# EAGLE design scHnRk_2 (EAGLE 7.5.0)
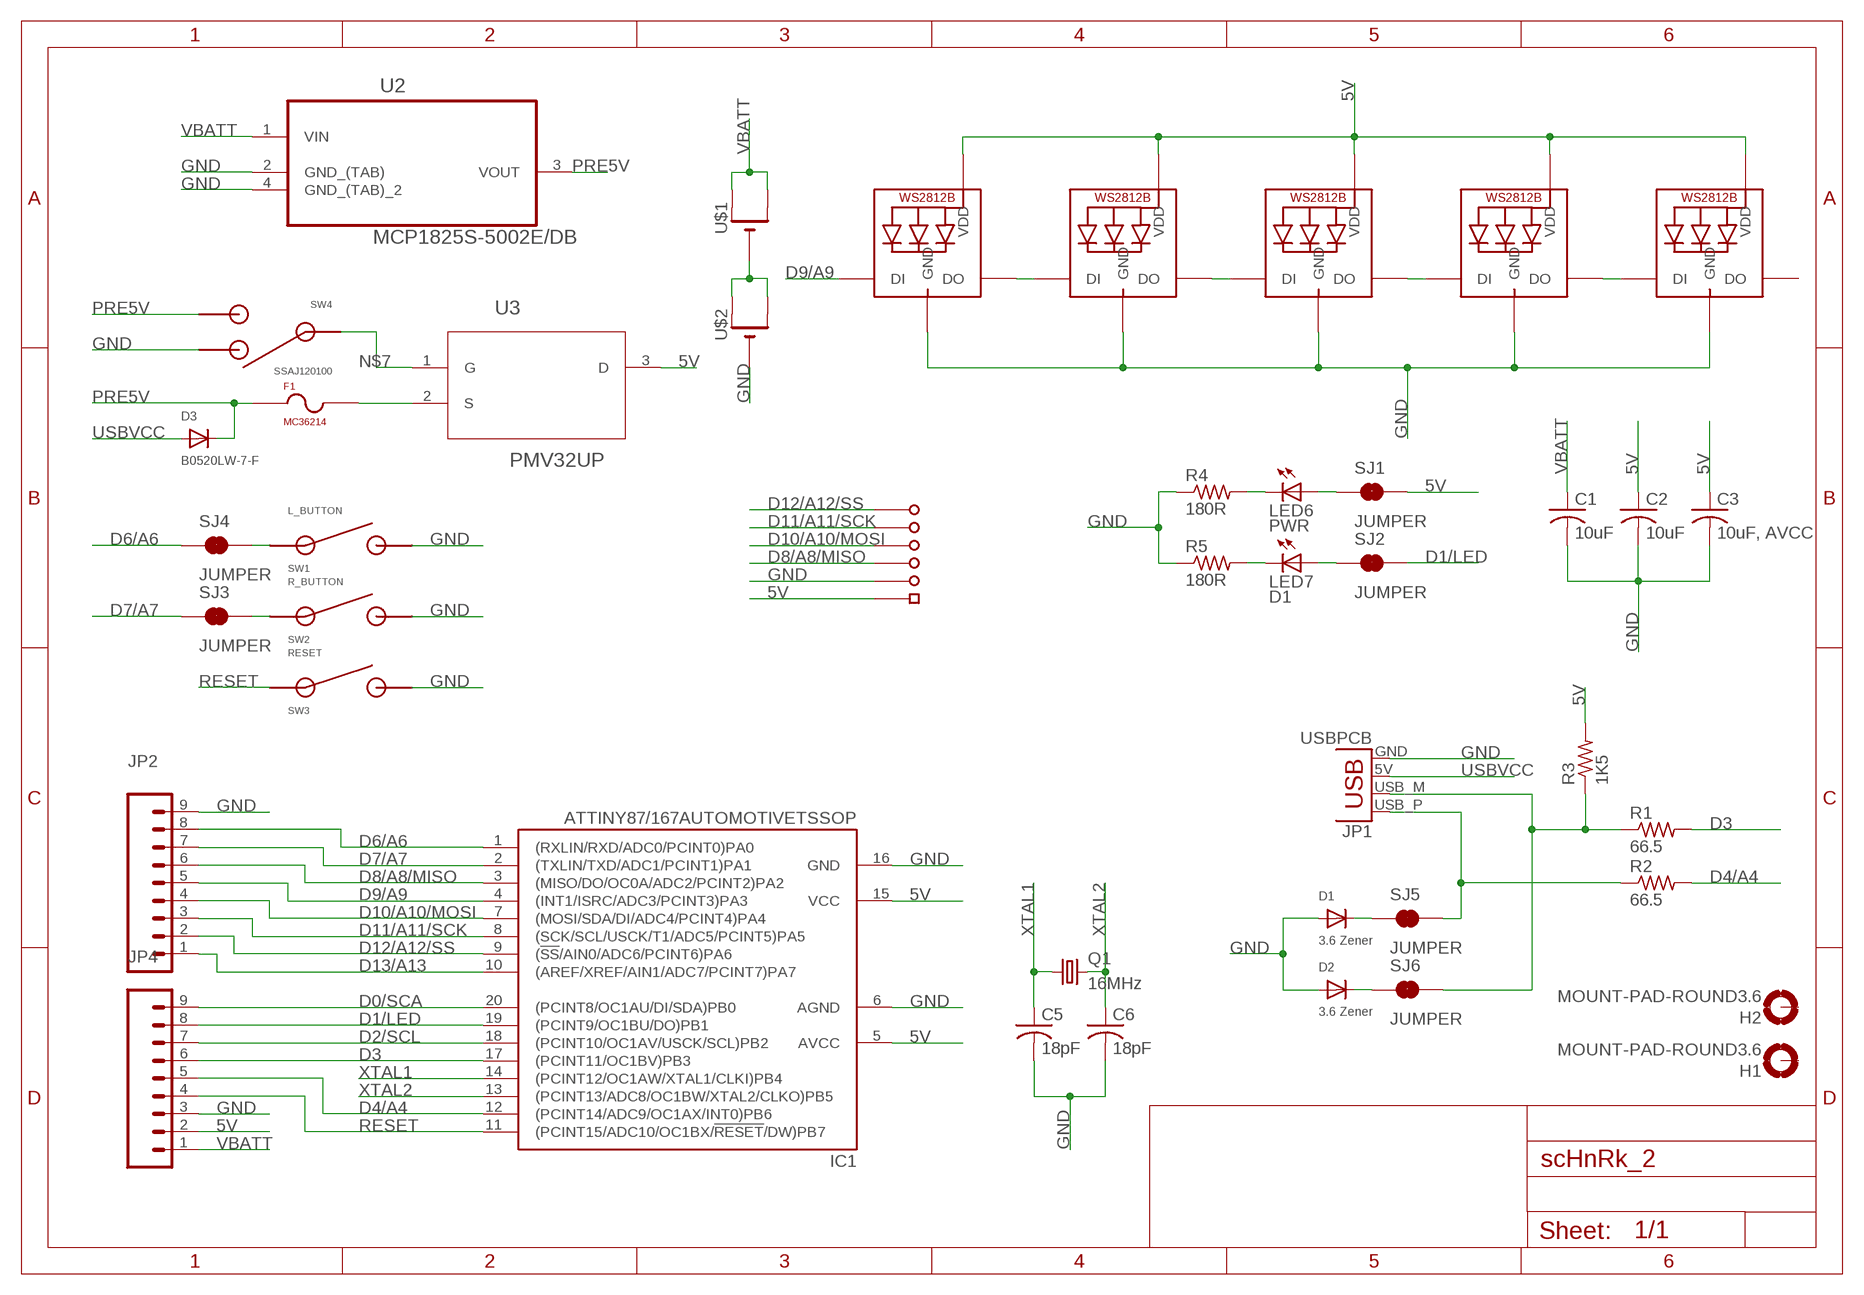
[diagram p0: schematic, sheet 1]

## Parts
C1  10uF  C-USC1206K  [C1206K]
C2  10uF  C-USC1206K  [C1206K]
C3  10uF, AVCC  C-USC1206K  [C1206K]
C5  18pF  C-USC0603K  [C0603K]
C6  18pF  C-USC0603K  [C0603K]
D1  3.6 Zener  DIODESOD-523  [SOD-523]
D2  3.6 Zener  DIODESOD-523  [SOD-523]
D3  B0520LW-7-F  DIODESOD-123  [SOD-123]
F1  MC36214  [MC36214]
H1  MOUNT-PAD-ROUND3.6  [3,6-PAD]
H2  MOUNT-PAD-ROUND3.6  [3,6-PAD]
IC1  ATTINY87/167AUTOMOTIVETSSOP  [TSSOP20]
JP1  USBPCB  [USB-A-PCB]
JP2  M09  [1X09]
JP4  M09  [1X09]
LED1  WS2812B5050  [WS2812B]
LED2  WS2812B5050  [WS2812B]
LED3  WS2812B5050  [WS2812B]
LED4  WS2812B5050  [WS2812B]
LED5  WS2812B5050  [WS2812B]
LED6  PWR  LEDCHIPLED_0603  [CHIPLED_0603]
LED7  D1  LEDCHIPLED_0603  [CHIPLED_0603]
Q1  16MHz  CRYSTALHC49UP  [HC49UP]
R1  66.5  R-US_R0603  [R0603]
R2  66.5  R-US_R0603  [R0603]
R3  1K5  R-US_R0603  [R0603]
R4  180R  R-US_R0603  [R0603]
R5  180R  R-US_R0603  [R0603]
SJ1  JUMPER  JUMPER-PAD-2-NC_BY_TRACE  [PAD-JUMPER-2-NC_BY_TRACE_YES_SILK]
SJ2  JUMPER  JUMPER-PAD-2-NC_BY_TRACE  [PAD-JUMPER-2-NC_BY_TRACE_YES_SILK]
SJ3  JUMPER  JUMPER-PAD-2-NC_BY_TRACE  [PAD-JUMPER-2-NC_BY_TRACE_YES_SILK]
SJ4  JUMPER  JUMPER-PAD-2-NC_BY_TRACE  [PAD-JUMPER-2-NC_BY_TRACE_YES_SILK]
SJ5  JUMPER  JUMPER-PAD-2-NC_BY_TRACE  [PAD-JUMPER-2-NC_BY_TRACE_YES_SILK]
SJ6  JUMPER  JUMPER-PAD-2-NC_BY_TRACE  [PAD-JUMPER-2-NC_BY_TRACE_YES_SILK]
SW1  L_BUTTON  SKRBAGE010  [SKRBAGE010]
SW2  R_BUTTON  SKRBAGE010  [SKRBAGE010]
SW3  RESET  SKRBAGE010  [SKRBAGE010]
SW4  SSAJ120100  [SSAJ120100]
TP1  TP-R  [TP-R]
TP2  TP-S  [TP_S]
TP3  TP-R  [TP-R]
TP4  TP-R  [TP-R]
TP5  TP-R  [TP-R]
TP6  TP-R  [TP-R]
U2  MCP1825S-5002E/DB  [SOT230P700X180-4N]
U3  PMV32UP  [SOT95P230X110-3N]
U$1  CR2032SMT  [CR2032-SMD]
U$2  CR2032SMT  [CR2032-SMD]

## Nets
5V: C2.1 C3.1 IC1.5(AVCC) IC1.15(VCC) JP4.2 LED1.1-VDD(VDD) LED2.1-VDD(VDD) LED3.1-VDD(VDD) LED4.1-VDD(VDD) LED5.1-VDD(VDD) R3.2 SJ1.2 TP2.P$1 U3.3(D)
D0/SCA: IC1.20((PCINT8/OC1AU/DI/SDA)PB0) JP4.9
D1/LED: IC1.19((PCINT9/OC1BU/DO)PB1) JP4.8 SJ2.2
D2/SCL: IC1.18((PCINT10/OC1AV/USCK/SCL)PB2) JP4.7
D3: IC1.17((PCINT11/OC1BV)PB3) JP4.6 R1.2
D4/A4: IC1.12((PCINT14/ADC9/OC1AX/INT0)PB6) JP4.5 R2.2
D6/A6: IC1.1((RXLIN/RXD/ADC0/PCINT0)PA0) JP2.8 SJ4.1
D7/A7: IC1.2((TXLIN/TXD/ADC1/PCINT1)PA1) JP2.7 SJ3.1
D8/A8/MISO: IC1.3((MISO/DO/OC0A/ADC2/PCINT2)PA2) JP2.6 TP3.P$1
D9/A9: IC1.4((INT1/ISRC/ADC3/PCINT3)PA3) JP2.5 LED1.4-DIN(DI)
D10/A10/MOSI: IC1.7((MOSI/SDA/DI/ADC4/PCINT4)PA4) JP2.4 TP4.P$1
D11/A11/SCK: IC1.8((SCK/SCL/USCK/T1/ADC5/PCINT5)PA5) JP2.3 TP5.P$1
D12/A12/SS: IC1.9((!SS!/AIN0/ADC6/PCINT6)PA6) JP2.2 TP6.P$1
D13/A13: IC1.10((AREF/XREF/AIN1/ADC7/PCINT7)PA7) JP2.1
GND: C1.2 C2.2 C3.2 C5.2 C6.2 D1.A D2.A IC1.6(AGND) IC1.16(GND) JP1.GND JP2.9 JP4.3 LED1.3-GND(GND) LED2.3-GND(GND) LED3.3-GND(GND) LED4.3-GND(GND) LED5.3-GND(GND) R4.1 R5.1 SW1.P$2 SW1.P$4 SW2.P$2 SW2.P$4 SW3.P$2 SW3.P$4 SW4.P$1 TP1.P$1 U2.2(GND_(TAB)) U2.4(GND_(TAB)_2) U$2.-
N$1: U$1.- U$2.+$1(+) U$2.+$2(+1)
N$2: SJ4.2 SW1.P$1 SW1.P$3
N$3: LED1.2-DOUT(DO) LED2.4-DIN(DI)
N$4: LED2.2-DOUT(DO) LED3.4-DIN(DI)
N$5: LED3.2-DOUT(DO) LED4.4-DIN(DI)
N$6: LED4.2-DOUT(DO) LED5.4-DIN(DI)
N$7: SW4.P$C U3.1(G)
N$8: SJ3.2 SW2.P$1 SW2.P$3
N$9: D1.K(C) SJ5.1
N$10: D2.K(C) SJ6.1
N$15: JP1.USB_M(D-) R1.1 R3.1 SJ6.2
N$16: JP1.USB_P(D+) R2.1 SJ5.2
N$22: F1.P$2 U3.2(S)
N$28: LED6.C R4.2
N$29: LED7.C R5.2
N$31: LED6.A SJ1.1
N$34: LED7.A SJ2.1
PRE5V: D3.C F1.P$1 SW4.P$2 U2.3(VOUT)
RESET: IC1.11((PCINT15/ADC10/OC1BX/!RESET!/DW)PB7) JP4.4 SW3.P$1 SW3.P$3
USBVCC: D3.A JP1.5V(VBUS)
VBATT: C1.1 JP4.1 U2.1(VIN) U$1.+$1(+) U$1.+$2(+1)
XTAL1: C5.1 IC1.14((PCINT12/OC1AW/XTAL1/CLKI)PB4) Q1.1
XTAL2: C6.1 IC1.13((PCINT13/ADC8/OC1BW/XTAL2/CLKO)PB5) Q1.2
Unconnected: H1.B3,6(MOUNT) H2.B3,6(MOUNT) LED5.2-DOUT(DO)

## Library data of the parts
C1-C3 C5 C6 = adafruit:C-US: CAPACITOR, American symbol
D1-D3 = adafruit:DIODE: Diode SMADIODE - SMA Surface Mount Package 20V 1A Schottky Diode Digikey: 641-1014-6-ND DO-1N4148 - Through Hole Small Current Diode SOD-123 20V 1 A (.5mV Vf) Schottky Diode - Digikey: MBRX120TPMSCT-ND SOD-323 10V 570mA (.38mV Vf, 3ns) Schottky Diode - Digikey: ZLLS410CT-ND SOD-523 30V 30mA Schottky Diode (RB751S-40TE61) - Digikey: RB751S-40TE61CT-ND SOT23-R/W - SOT23 Package (R = Solder Paste/Reflow Ovens, W = Hand-Soldering) BAT54Film 40V 300mA - Digikey: 497-7162-1-ND
F1 = scHnRk:MC36214
H1 H2 = holes:MOUNT-PAD-ROUND: MOUNTING PAD, round
IC1 = attiny87_167_automotive:ATTINY87/167AUTOMOTIVE
JP1 = SparkFun-Connectors:USB: USB Connectors USB-B-PTH is fully proven SKU : PRT-00139/CONN-08278 USB-miniB is fully proven SKU : PRT-00587 USB-A-PCB is untested. USB-A-H is throughly reviewed, but untested. Spark Fun Electronics SKU : PRT-00437 USB-B-SMT is throughly reviewed, but untested. Needs silkscreen touching up. USB-A-S has not been used/tested USB-MB-H has not been used/tested USB-MICROB has been used. CONN-09505
JP2 JP4 = SparkFun-Connectors:M09: Header 9 Standard 9-pin 0.1" header. Use with straight break away headers (SKU : PRT-00116), right angle break away headers (PRT-00553), swiss pins (PRT-00743), machine pins (PRT-00117), and female headers (PRT-00115).
LED1-LED5 = adafruit:WS2812B
LED6 LED7 = adafruit:LED: LED OSRAM: - CHIPLED LG R971, LG N971, LY N971, LG Q971, LY Q971, LO R971, LY R971 LH N974, LH R974 LS Q976, LO Q976, LY Q976 LO Q996 - Hyper CHIPLED LW Q18S LB Q993, LB Q99A, LB R99A - SideLED LS A670, LO A670, LY A670, LG A670, LP A670 LB A673, LV A673, LT A673, LW A673 LH A674 LY A675 LS A676, LA A676, LO A676, LY A676, LW A676 LS A679, LY A679, LG A679 - Hyper Micro SIDELED® LS Y876, LA Y876, LO Y876, LY Y876 LT Y87S - SmartLED LW L88C, LW L88S LB L89C, LB L89S, LG L890 LS L89K, LO L89K, LY L89K LS L896, LA L896, LO L896, LY L896 - TOPLED LS T670, LO T670, LY T670, LG T670, LP T670 LSG T670, LSP T670, LSY T670, LOP T670, LYG T670 LG T671, LOG T671, LSG T671 LB T673, LV T673, LT T673, LW T673 LH T674 LS T676, LA T676, LO T676, LY T676, LB T676, LH T676, LSB T676, LW T676 LB T67C, LV T67C, LT T67C, LS T67K, LO T67K, LY T67K, LW E67C LS E67B, LA E67B, LO E67B, LY E67B, LB E67C, LV E67C, LT E67C LW T67C LS T679, LY T679, LG T679 LS T770, LO T770, LY T770, LG T770, LP T770 LB T773, LV T773, LT T773, LW T773 LH T774 LS E675, LA E675, LY E675, LS T675 LS T776, LA T776, LO T776, LY T776, LB T776 LHGB T686 LT T68C, LB T68C - Hyper Mini TOPLED® LB M676 - Mini TOPLED Santana® LG M470 LS M47K, LO M47K, LY M47K Source: http://www.osram.convergy.de/
Q1 = adafruit:CRYSTAL: CRYSTAL; OC_FARNELL: unknown; OC_NEWARK: unknown
R1-R5 = adafruit:R-US_: RESISTOR, American symbol
SJ1-SJ6 = SparkFun-Passives:JUMPER-PAD-2-NC_BY_TRACE
SW1-SW3 = scHnRk:SKRBAGE010
SW4 = scHnRk:SSAJ120100
TP1 TP3-TP6 = scHnRk:TP-R
TP2 = scHnRk:TP-S
U2 = Microchip_By_element14_Batch_1:MCP1825S-5002E/DB: IC, LDO, 5.0V, 500MA; MPN: MCP1825S-5002E/DB; OC_FARNELL: 1578407; OC_NEWARK: 26M9964; PACKAGE: SOT-223-3; SUPPLIER: Microchip
U3 = NXP_By_element14_Batch_1:PMV32UP: P-channel Trench MOSFET; MPN: PMV32UP; OC_FARNELL: 1894624; OC_NEWARK: 47T2356; PACKAGE: SOT-3; SUPPLIER: NXP Semiconductors
U$1 U$2 = adafruit:CR2032

## Board
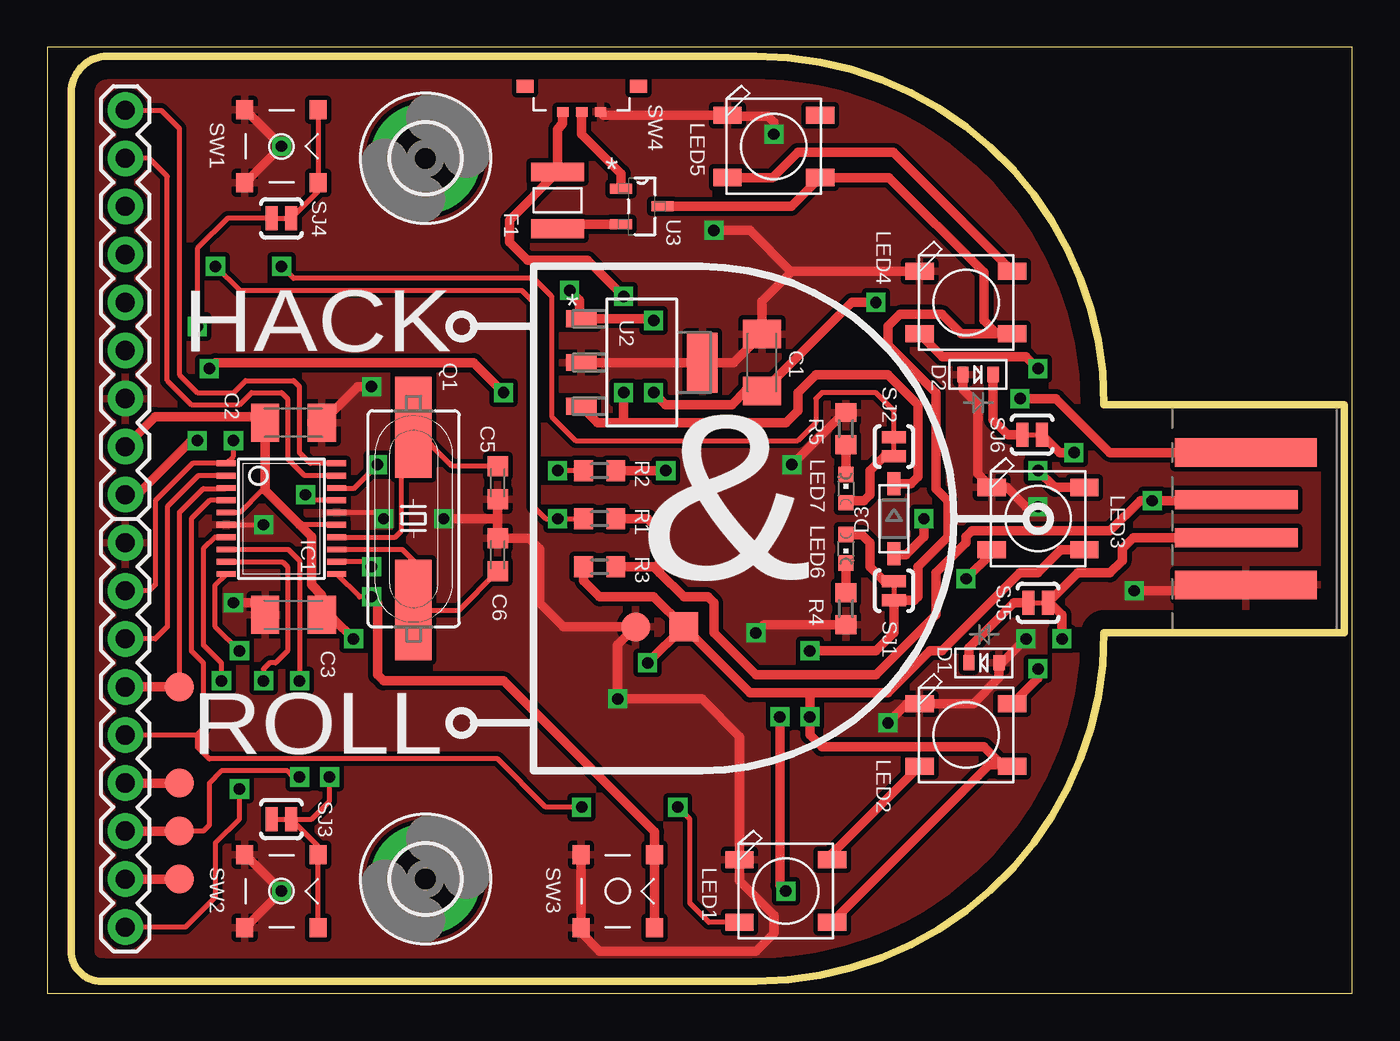
[diagram p1: board, top side]
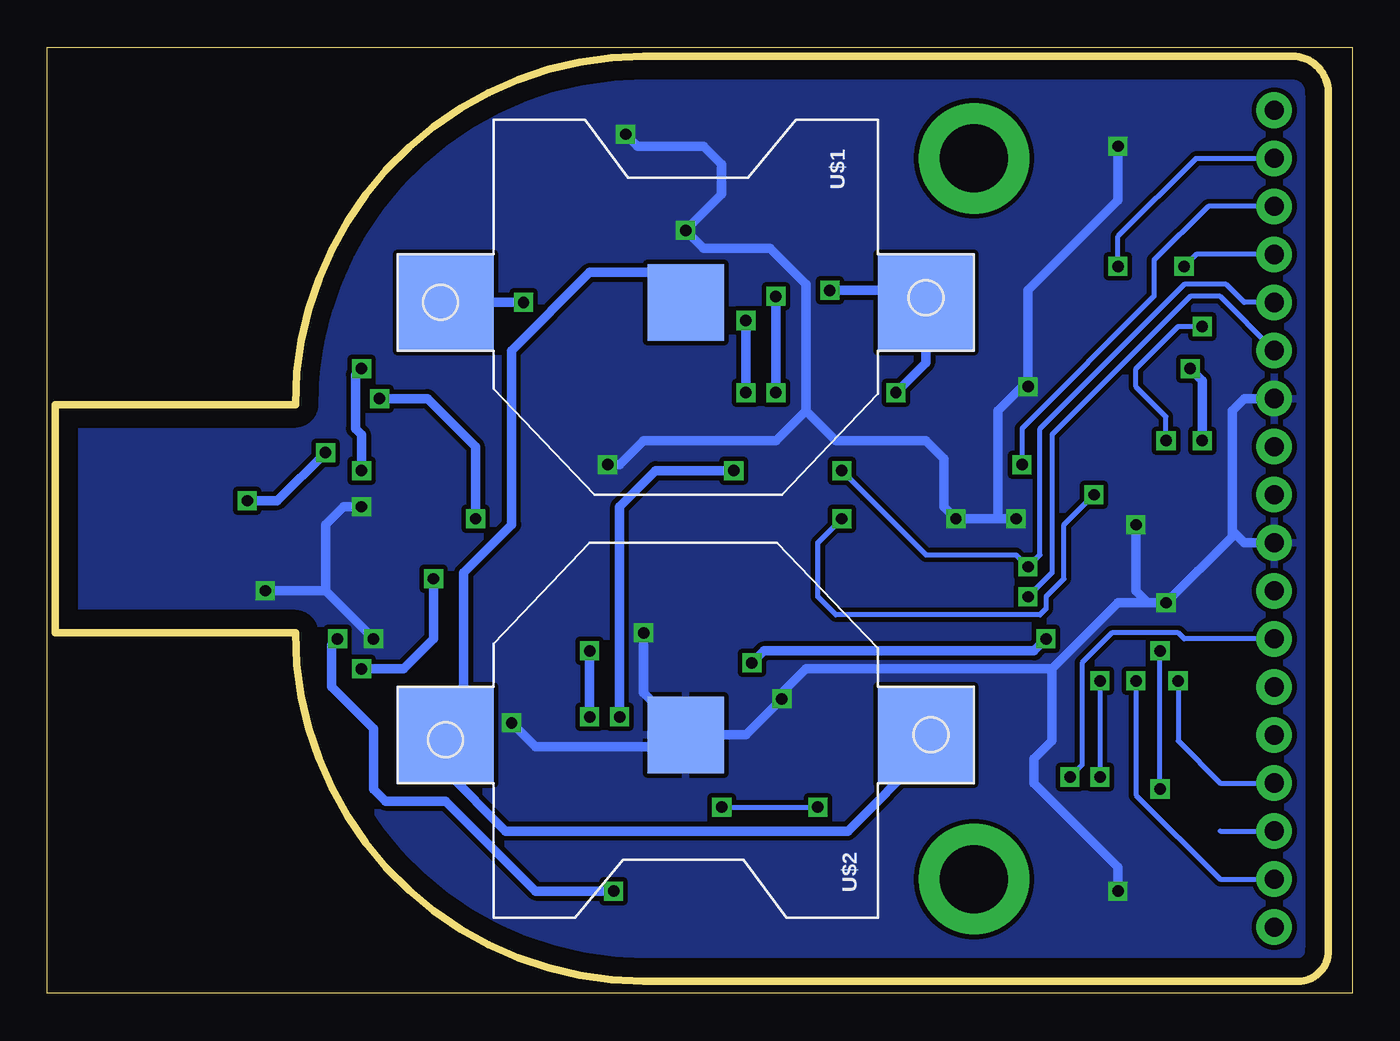
[diagram p2: board, bottom side, seen from below]

Size 69 x 50 mm. Coordinates in mm from the lower left corner, seen from the top.
Outline: 0,0 69,0 69,50 0,50 0,0
Outline: 3.17,49.53 arc90 1.27,47.62 1.27,2.22 arc90 2.86,0.64 37.47,0.64 arc90 55.88,19.05 68.58,19.05 68.58,31.11 55.88,31.11 arc90 37.47,49.53 3.17,49.53
Copper layers (1*16): Top 0.035mm / dielectric 1.5mm / Bottom 0.035mm
Design rules "default *": minimum track width 10mil, minimum drill 20mil, track to track 10mil, track to pad 10mil, pad to pad 10mil, via to via 12mil, smd to smd 10mil, copper to edge 40mil, drill to drill 20mil, minimum pad ring 10mil, minimum via ring 8mil, stop-mask expansion 4mil, vias tented up to drill 0mil, thermal gap 10mil

### Footprints (pad centres in the part's own frame; a part is rotated, then mirrored left to right if it is on the bottom)
C1206K = smd 1.5 x 2: 1 -1.5,0; 2 1.5,0
C0603K = smd 1.05 x 1.08: 1 -0.875,0; 2 0.875,0
SOD-523 = smd 0.8 x 0.6: A 0,-0.8; K 0,0.8
SOD-123 = smd 1.2 x 0.7: A 1.85,0; C -1.85,0
MC36214 = smd 1 x 2.8: P$1 -1.5,0; P$2 1.5,0
3,6-PAD = drill 3.6 pad 5.842: B3,6 0,0
TSSOP20 = smd 0.305 x 0.991: 1 -2.925,-2.918; 2 -2.275,-2.918; 3 -1.625,-2.918; 4 -0.975,-2.918; 5 -0.325,-2.918; 6 0.325,-2.918; 7 0.975,-2.918; 8 1.625,-2.918; 9 2.275,-2.918; 10 2.925,-2.918; 11 2.925,2.918; 12 2.275,2.918; 13 1.625,2.918; 14 0.975,2.918; 15 0.325,2.918; 16 -0.325,2.918; 17 -0.975,2.918; 18 -1.625,2.918; 19 -2.275,2.918; 20 -2.925,2.918
USB-A-PCB = smd 7.5 x 1.5: 5V -0.2,-3.5; GND -0.2,3.5 | smd 6.5 x 1: USB_M 0.3,-1; USB_P 0.3,1
1X09 = drill 1.016 pad 1.88: 1 0,0; 2 2.54,0; 3 5.08,0; 4 7.62,0; 5 10.16,0; 6 12.7,0; 7 15.24,0; 8 17.78,0; 9 20.32,0
WS2812B = smd 1.5 x 0.9: 1-VDD 2.45,-1.65; 2-DOUT 2.45,1.65; 3-GND -2.45,1.65; 4-DIN -2.45,-1.65
CHIPLED_0603 = smd 0.8 x 0.8: A 0,-0.75; C 0,0.75
HC49UP = smd 5.334 x 1.93: 1 -4.826,0; 2 4.826,0
R0603 = smd 1 x 1.1: 1 -0.85,0; 2 0.85,0
PAD-JUMPER-2-NC_BY_TRACE_YES_SILK = smd 0.635 x 1.27: 1 -0.508,0; 2 0.508,0
SKRBAGE010 = smd 1 x 0.9: P$1 -1.925,1.95; P$2 -1.925,-1.95; P$3 1.925,1.95; P$4 1.925,-1.95
SSAJ120100 = smd 0.6 x 0.51: P$1 -1,1.36; P$2 1,1.36; P$C 0,1.36 | smd 0.9 x 0.7: P$3 -3,0; P$4 3,0
TP-R = smd 1.524 x 1.524: P$1 0,0
TP_S = smd 1.524 x 1.524: P$1 0,0
SOT230P700X180-4N = smd 1.626 x 0.889: 1 -3.2,2.311; 2 -3.2,0; 3 -3.2,-2.311 | smd 1.626 x 3.175: 4 3.2,0
SOT95P230X110-3N = smd 1.168 x 0.533: 1 -1.092,0.94; 2 -1.092,-0.94; 3 1.092,0
CR2032-SMD = smd 5.08 x 5.08: +$1 -12.7,0; +$2 12.7,0 | smd 4.064 x 4.064: - 0,0

### Placement (x,y rotation side)
C1  37.78,33.34 90 top
C2  13.02,30.16 0 top
C3  13.02,20 180 top
C5  23.81,26.99 270 top
C6  23.81,23.18 90 top
D1  49.53,17.46 90 top
D2  49.21,32.7 270 top
D3  44.77,25.08 270 top
F1  26.99,41.91 270 top
H1  20,44.13 0 top
H2  20,6.03 0 top
IC1  12.38,25.08 270 top
JP1  63.18,25.08 180 top
JP2  4.13,3.49 90 top
JP4  4.13,26.35 90 top
LED1  39.05,5.4 0 top
LED2  48.58,13.65 0 top
LED3  52.39,25.08 0 top
LED4  48.58,36.51 0 top
LED5  38.42,44.77 0 top
LED6  42.23,23.5 180 top
LED7  42.23,26.67 0 top
Q1  19.37,25.08 270 top
R1  29.21,25.08 180 top
R2  29.21,27.62 180 top
R3  29.21,22.54 180 top
R4  42.23,20.32 90 top
R5  42.23,29.84 270 top
SJ1  44.77,21.27 270 top
SJ2  44.77,28.89 90 top
SJ3  12.38,9.21 0 top
SJ4  12.38,40.96 0 top
SJ5  52.39,20.64 0 top
SJ6  52.07,29.53 0 top
SW1  12.38,44.77 270 top
SW2  12.38,5.4 270 top
SW3  30.16,5.4 270 top
SW4  28.26,47.94 180 top
TP1  31.11,19.37 90 top
TP2  33.66,19.37 90 top
TP3  6.99,16.19 90 top
TP4  6.99,11.11 180 top
TP5  6.99,8.57 180 top
TP6  6.99,6.03 180 top
U2  31.43,33.34 0 top
U3  31.43,41.59 0 top
U$1  35.24,36.51 0 bottom
U$2  35.24,13.65 180 bottom

### Tracks (layer width: path | path; a pad name or v marks a point on that pad's centre or on a via)
5V  (via drill 0.6)
  Top 0.254: 33.02,20 TP2.P$1 | 11.52,26.58 11.34,26.58 10.16,25.4 9.47,25.4 IC1.5 | IC1.15 13.34,24.76 13.34,24.77
  Top 0.508: U3.3 39.34,41.59 LED5.1-VDD 44.51,43.12 49.53,38.1 49.53,35.56 50.16,34.92 50.97,34.92 LED4.1-VDD 48.32,34.86 47.31,35.88 45.09,35.88 44.45,35.24 44.45,34.29 46.99,31.75 46.99,26.67 47.62,26.04 47.62,24.13 46.04,22.54 46.04,20.95 45.85,20.77 SJ1.2 44.77,19.05 43.81,18.1 v40.32,18.1 | LED3.1-VDD 53.59,23.43 52.39,22.23 51.44,22.23 47.31,18.1 46.67,18.1 44.45,15.88 40.32,15.88 | 50.48,12.06 49.53,13.02 40.96,13.02 40.32,13.65 v40.32,14.61 40.32,15.88 | 50.48,12.06 50.97,12.06 LED2.1-VDD | 50.48,12.06 49.82,12.06 LED1.1-VDD | 11.11,30.48 5.71,30.48 JP4.2 | 11.11,30.48 11.2,30.48 C2.1 | C2.1 11.43,30.16 11.11,30.48 | TP2.P$1 32.07,20.95 29.21,20.95 28.36,21.8 R3.2 | v31.75,17.46 TP2.P$1 | v16.19,18.73 15.15,19.77 14.52,19.77 C3.1 14.52,21.04 13.97,21.59 13.97,24.13 13.34,24.77 11.52,26.58 C2.1 | 40.32,15.88 37.15,15.88 TP2.P$1
  Bottom 0.508: v40.32,18.1 v40.32,14.61 | v16.19,18.73 16.83,18.1 31.11,18.1 v31.75,17.46
D0/SCA
  Top 0.254: IC1.20 13.9,28.01 13.34,28.57 13.34,32.07 13.02,32.38 10.48,32.38 9.84,31.75 7.94,31.75 6.99,32.7 6.99,45.72 6.03,46.67 JP4.9
D1/LED  (via drill 0.6)
  Top 0.254: IC1.19 13.6,27.36 12.7,28.26 12.7,31.43 12.38,31.75 10.79,31.75 10.16,31.11 7.62,31.11 6.35,32.38 6.35,43.18 5.4,44.13 JP4.8 | SJ2.2 44.77,30.8 43.81,31.75 40.96,31.75 40.64,31.43 40.64,30.16 39.69,29.21 27.94,29.21 26.67,30.48 26.67,36.83 25.72,37.78 13.02,37.78 v12.38,38.42
  Bottom 0.254: JP4.8 8.26,44.13 12.38,40.01 v12.38,38.42
D2/SCL  (via drill 0.6)
  Top 0.254: IC1.18 15.34,26.67 16.19,26.67 v17.46,27.94
  Bottom 0.254: JP4.7 7.62,41.59 10.48,38.73 10.48,36.83 17.46,29.84 v17.46,27.94
D3  (via drill 0.6)
  Top 0.254: IC1.17 13.95,26.06 v13.65,26.35 | v8.89,38.42 10.16,37.15 25.08,37.15 25.72,36.51 25.72,25.72 26.35,25.08 v26.99,25.08 R1.2
  Bottom 0.254: JP4.6 8.26,39.05 v8.89,38.42 | v13.65,26.35 15.24,24.77 15.24,21.91 16.19,20.95 16.19,20.32 16.51,20 27.3,20 28.26,20.95 28.26,23.81 v26.99,25.08
D4/A4  (via drill 0.6)
  Top 0.254: v17.14,22.54 16.88,22.81 IC1.12 | R2.2 v26.99,27.62
  Bottom 0.254: JP4.5 5.71,36.51 6.67,37.47 8.89,37.47 16.51,29.84 16.51,23.18 v17.14,22.54 17.78,23.18 22.54,23.18 v26.99,27.62
D6/A6  (via drill 0.6)
  Top 0.254: JP2.8 5.4,21.27 5.71,21.59 5.71,26.04 7.69,28.01 IC1.1 9.84,28.39 v9.84,29.21 | SJ4.1 9.53,40.96 7.94,39.37 v7.94,35.24
  Bottom 0.254: v9.84,29.21 9.84,30.48 11.43,32.07 11.43,33.02 9.21,35.24 v7.94,35.24
D7/A7  (via drill 0.6)
  Top 0.254: JP2.7 5.71,18.73 6.35,19.37 6.35,25.72 7.99,27.36 IC1.2 | SJ3.1 13.97,9.21 14.92,10.16 v14.92,11.43
  Bottom 0.254: JP2.7 8.89,18.73 9.21,19.05 12.7,19.05 14.29,17.46 14.29,12.06 v14.92,11.43
D8/A8/MISO
  Top 0.254: IC1.3 9.43,26.67 8.26,26.67 6.99,25.4 TP3.P$1
  Top 0.508: JP2.6 TP3.P$1
D9/A9  (via drill 0.6)
  Top 0.254: 7.94,13.65 7.94,13.02 8.57,12.38 23.81,12.38 26.35,9.84 v28.26,9.84 | JP2.5 7.94,13.65 | LED1.4-DIN 34.99,3.75 33.97,4.76 33.97,9.21 v33.34,9.84 | IC1.4 8.6,26.06 7.62,25.08 7.62,18.1 8.26,17.46 8.26,13.97 7.94,13.65
  Bottom 0.254: v33.34,9.84 v28.26,9.84
D10/A10/MOSI  (via drill 0.6)
  Top 0.254: IC1.7 8.87,24.11 8.26,23.5 8.26,18.41 9.21,17.46 v9.21,16.51
  Top 0.508: JP2.4 TP4.P$1
  Bottom 0.254: v9.21,16.51 9.21,13.34 TP4.P$1 JP2.4
D11/A11/SCK  (via drill 0.6)
  Top 0.254: IC1.8 12.74,23.46 13.34,22.86 v13.34,16.51 | v13.34,11.43 13.02,11.43 12.7,11.75 9.21,11.75 8.57,11.11 8.57,8.89 8.26,8.57 TP5.P$1
  Top 0.508: JP2.3 TP5.P$1
  Bottom 0.254: TP5.P$1 JP2.3 | v13.34,16.51 v13.34,11.43
D12/A12/SS  (via drill 0.6)
  Top 0.254: IC1.9 12.44,22.81 12.7,22.54 12.7,18.1 12.06,17.46 11.75,17.46 11.43,17.14 v11.43,16.51
  Top 0.508: JP2.2 TP6.P$1
  Bottom 0.254: v11.43,16.51 11.43,10.48 TP6.P$1 JP2.2
D13/A13  (via drill 0.6)
  Top 0.254: v10.16,18.1 8.89,19.37 8.89,21.58 IC1.10 | JP2.1 7.3,3.49 8.89,5.08 8.89,7.94 10.16,9.21 v10.16,10.79
  Bottom 0.254: v10.16,10.79 v10.16,18.1
GND  (via drill 0.6)
  Top 0.254: 14.61,30.25 C2.2 14.61,30.16 | SW1.P$2 10.46,46.69 | SW1.P$4 10.46,42.84 | IC1.16 17.45,25.41 v17.78,25.08 | IC1.6 9.47,24.77 v11.43,24.77 | SW2.P$2 10.46,7.32 | C3.2 11.52,20.64
  Top 0.508: v35.24,40.32 37.15,40.32 39.31,38.16 39.37,38.16 | v38.42,45.4 38.42,46.04 38.1,46.35 36.03,46.35 LED5.3-GND 29.42,46.42 SW4.P$1 | U2.2 U2.4 36.28,33.34 C1.2 37.78,36.58 39.37,38.16 | v51.75,18.73 50.48,17.46 D1.A 50.33,16.68 48.96,15.3 LED2.3-GND 45.47,15.3 v44.45,14.29 | v57.47,21.27 63.07,21.27 JP1.GND | 42.12,30.7 R5.1 42.23,30.8 v39.37,27.94 | C5.2 23.81,25.08 | 23.81,25.08 C6.2 25.48,24.05 26.04,23.5 26.04,20.64 27.3,19.37 TP1.P$1 30.16,18.41 v30.16,15.56 34.61,15.56 36.6,13.56 LED1.3-GND | 36.51,6.96 LED1.3-GND | LED1.3-GND 36.6,5.94 38.42,4.13 38.42,3.17 37.47,2.22 29.21,2.22 28.21,3.22 SW3.P$4 SW3.P$2 | R4.1 37.88,19.47 v37.47,19.05 | v20.95,25.08 23.81,25.08 | v17.14,32.07 16.42,32.07 C2.2 | 10.46,46.69 v12.38,44.77 10.46,42.84 | LED4.3-GND 39.37,38.16 | D2.A 48.41,31.91 49.21,31.11 49.21,27.46 LED3.3-GND 50.74,26.73 51.75,25.72 v52.39,25.72 | v9.84,20.64 11.52,20.64 | 10.46,7.32 v12.38,5.4 10.46,3.47 SW2.P$4
  Bottom 0.508: v38.42,45.4 37.78,44.77 34.29,44.77 33.34,43.81 33.34,42.23 v35.24,40.32 34.29,39.37 30.8,39.37 28.89,37.47 28.89,30.8 | v51.75,18.73 54.29,21.27 | 54.29,21.27 v57.47,21.27 | v39.37,27.94 38.73,27.94 37.47,29.21 30.48,29.21 28.89,30.8 | U$2.- 32.07,13.65 v30.16,15.56 30.16,15.88 28.89,17.14 15.88,17.14 | JP4.3 5.71,31.43 6.35,30.8 6.35,24.45 | 6.35,24.45 5.71,23.81 JP2.9 | v37.47,19.05 37.47,15.88 U$2.- | U$2.- 35.88,13.02 43.18,13.02 v44.45,14.29 | 28.89,30.8 27.3,29.21 22.54,29.21 21.59,28.26 21.59,25.72 v20.95,25.08 18.73,25.08 | v17.78,25.08 18.73,25.08 | 18.73,25.08 18.73,30.8 17.46,32.07 v17.14,32.07 17.14,37.15 12.38,41.91 v12.38,44.77 | v52.39,25.72 53.34,25.72 54.29,24.77 54.29,21.27 | 6.35,24.45 6.35,24.13 v9.84,20.64 10.79,20.64 | v11.43,24.77 11.43,21.27 10.79,20.64 | 15.88,17.14 12.38,20.64 10.79,20.64 | v12.38,5.4 12.38,6.67 16.83,11.11 16.83,12.38 15.88,13.34 15.88,17.14
  pour Top: 55.88,31.11 arc90 37.47,49.53 3.17,49.53 arc90 1.27,47.62 1.27,2.22 arc90 2.86,0.64 37.47,0.64 arc90 55.88,19.05 68.58,19.05 68.58,31.11
  pour Bottom: 55.88,31.11 arc90 37.47,49.53 3.17,49.53 arc90 1.27,47.62 1.27,2.22 arc90 2.86,0.64 37.47,0.64 arc90 55.88,19.05 68.58,19.05 68.58,31.11
N$1
  Bottom 0.508: U$2.+$1 22.54,12.7 26.67,8.57 44.77,8.57 47.94,11.75 U$2.+$2 46.99,14.61 | 46.67,14.92 46.99,14.61 | 46.99,14.61 46.99,22.23 44.45,24.77 44.45,33.97 40.32,38.1 36.83,38.1 U$1.-
N$2
  Top 0.254: SJ4.2 14.33,42.4 SW1.P$3 SW1.P$1
N$3
  Top 0.508: LED1.2-DOUT 41.5,7.38 LED2.4-DIN
N$4  (via drill 0.6)
  Top 0.508: 51.18,15.3 LED2.2-DOUT 52.39,16.66 v52.39,17.14 | LED3.4-DIN 49.94,23.27 v48.58,21.91
  Bottom 0.508: v52.39,17.14 50.16,17.14 48.58,18.73 v48.58,21.91
N$5  (via drill 0.6)
  Top 0.508: LED3.2-DOUT 53.28,26.73 v52.39,27.62 | v52.39,33.02 51.75,33.66 47.34,33.66 LED4.4-DIN
  Bottom 0.508: v52.39,33.02 52.7,32.7 52.7,29.84 52.39,29.53 v52.39,27.62
N$6
  Top 0.508: LED5.4-DIN 38.35,43.12 39.69,44.45 44.74,44.45 LED4.2-DOUT
N$7
  Top 0.508: SW4.P$C 28.26,45.4 30.34,43.32 U3.1
N$8
  Top 0.254: SW2.P$3 SW2.P$1 14.33,7.77 SJ3.2
N$9
  Top 0.508: SJ5.1 51.12,20.64 48.73,18.25 D1.K
N$10
  Top 0.508: D2.K 50.01,30.32 50.8,29.53 SJ6.1
N$15  (via drill 0.6)
  Top 0.508: JP1.USB_M 62.84,26.04 v58.42,26.04 57.78,26.04 56.2,24.45 48.9,24.45 48.58,24.13 48.58,23.81 46.99,22.23 46.99,20 43.81,16.83 37.47,16.83 35.24,19.05 35.24,20.64 34.92,20.95 33.66,20.95 32.38,22.23 | v54.29,28.57 53.53,28.57 SJ6.2 | 32.38,22.23 32.38,24.45 31.75,25.08 R1.1 | R3.1 32.07,22.54 32.38,22.23
  Bottom 0.508: v54.29,28.57 56.83,26.04 v58.42,26.04
N$16  (via drill 0.6)
  Top 0.508: JP1.USB_P 57.42,24.08 56.83,23.5 56.83,22.86 56.2,22.23 54.48,22.23 SJ5.2 53.02,20.64 53.66,20 v53.66,18.73 | v32.7,27.62 R2.1 | v38.73,14.61 38.73,5.71 v39.05,5.4
  Bottom 0.508: v53.66,18.73 53.98,18.41 53.98,16.19 51.75,13.97 51.75,10.79 51.12,10.16 47.94,10.16 43.18,5.4 v39.05,5.4 | v38.73,14.61 38.73,25.72 36.83,27.62 v32.7,27.62
N$22
  Top 0.508: F1.P$2 27.23,40.65 U3.2
N$28
  Top 0.508: LED6.C R4.2
N$29
  Top 0.508: R5.2 LED7.C
N$31
  Top 0.508: SJ1.1 44.26,21.78 43.5,22.54 43.5,23.81 43.06,24.25 LED6.A
N$34
  Top 0.508: SJ2.1 44.26,28.38 43.5,27.62 43.5,26.35 43.18,26.04 42.34,26.04 LED7.A
PRE5V  (via drill 0.6)
  Top 0.508: D3.C 45.66,26.93 46.04,27.3 46.04,31.11 44.45,32.7 40.64,32.7 39.69,31.75 39.69,30.8 39.05,30.16 30.48,30.16 | 30.48,30.16 29.1,30.16 U2.3 | v30.48,36.83 28.57,38.73 25.4,38.73 24.45,39.69 24.45,40.87 F1.P$1 26.99,45.68 27.26,45.95 SW4.P$2 | v30.48,31.75 30.48,30.16
  Bottom 0.508: v30.48,36.83 v30.48,31.75
RESET  (via drill 0.6)
  Top 0.254: v17.14,20.95 16.5,20.95 IC1.11
  Top 0.508: SW3.P$3 SW3.P$1 32.11,8.53 24.13,16.51 17.78,16.51 17.46,16.83 17.46,20.64 v17.14,20.95
  Bottom 0.254: v17.14,20.95 15.88,22.23 15.88,29.53 8.57,36.83 6.99,36.83 JP4.4
USBVCC  (via drill 0.6)
  Top 0.508: JP1.5V 56.2,28.57 53.34,31.43 v51.44,31.43 | D3.A 44.82,23.18 45.4,23.18 46.35,24.13 v46.35,25.08
  Bottom 0.508: v51.44,31.43 48.9,31.43 46.35,28.89 v46.35,25.08
VBATT  (via drill 0.6)
  Top 0.508: v8.57,33.02 8.89,33.34 22.54,33.34 v24.13,31.75 | 28.32,35.56 U2.1 | v32.07,31.75 32.7,31.11 36.2,31.11 36.92,31.84 C1.1 37.87,31.84 42.55,36.51 v43.81,36.51 | v32.07,35.56 31.98,35.65 U2.1 | U2.1 28.14,35.56 28.14,36.63 v27.62,37.15 | JP4.1 4.76,26.35 7.62,29.21 v7.94,29.21
  Bottom 0.508: v7.94,29.21 7.94,32.38 v8.57,33.02 | v32.07,31.75 v32.07,35.56 | U$1.+$2 22.54,33.34 v24.13,31.75 | 22.86,36.83 U$1.+$2 | v27.62,37.15 23.18,37.15 U$1.+$2 | 46.04,38.42 U$1.+$1 v43.81,36.51
XTAL1
  Top 0.254: C5.1 21.41,27.86 Q1.1 18.73,29.27 18.73,24.45 18.39,24.11 IC1.14
XTAL2
  Top 0.254: IC1.13 18.77,23.46 19.37,22.86 Q1.2 21.77,20.26 C6.1

### Text on the board
tNames: HACK | & | ROLL